# Altium schematic sheet config-bank0.SchDoc: Config FPGA - Bank 0
size Letter; CheckedBy: E. Chiu; CompanyName: Brinton Engineering, LLC; DrawnBy: J. Brinton; Engineer: J. Brinton; Address1: 3479 Edison Way; Address2: Menlo Park CA 94025; Address3: +1 (877) 778-8435; Address4: brintonengineering.com; Revision: 1; SheetNumber: 18; SheetTotal: 71
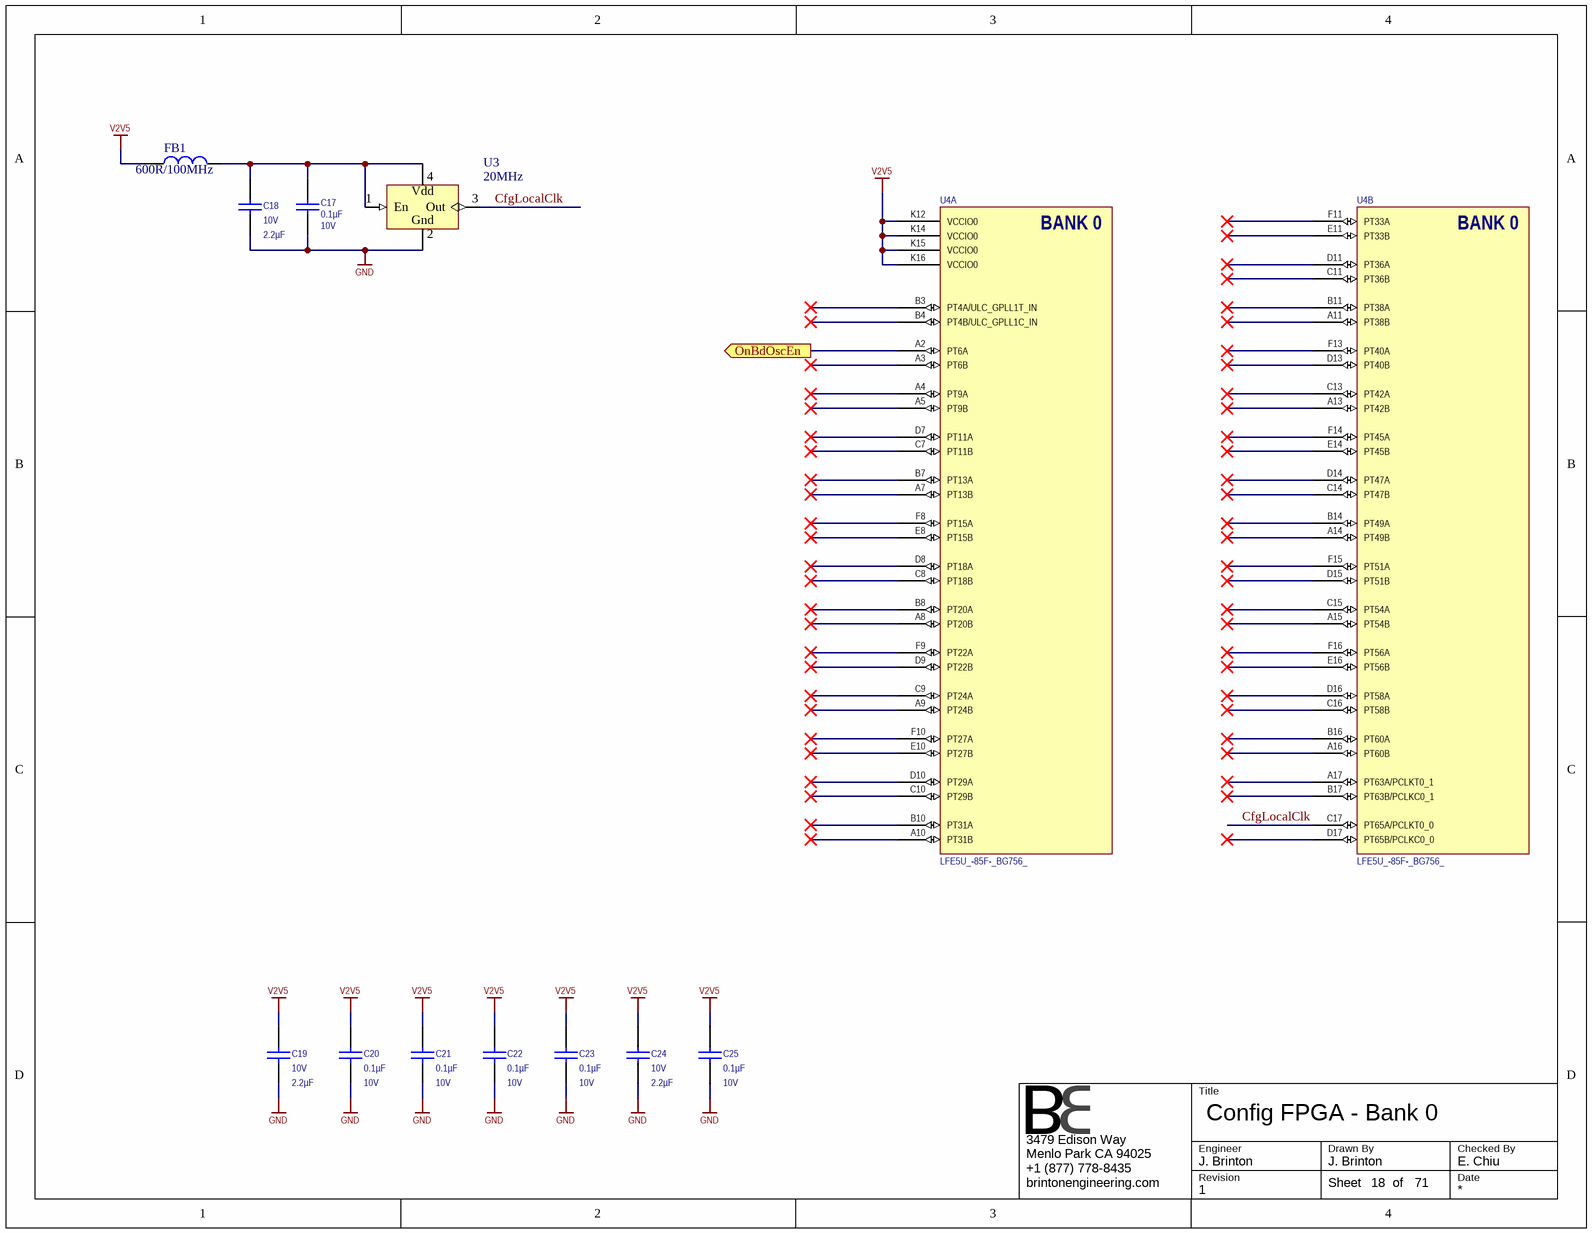
[diagram p0: config-bank0.SchDoc]

## Parts
C17  Capacitance: 0.1µF  Voltage - Rated: 10V  [CAPC1005X56N]  (hidden comment: GRM155R71A104KA01J)
C18  Voltage - Rated: 10V  Capacitance: 2.2µF  [CAPC1608X90N]  (hidden comment: GRM188R71A225KE15D)
C19  Voltage - Rated: 10V  Capacitance: 2.2µF  [CAPC1608X90N]  (hidden comment: GRM188R71A225KE15D)
C20  Capacitance: 0.1µF  Voltage - Rated: 10V  [CAPC1005X56N]  (hidden comment: GRM155R71A104KA01J)
C21  Capacitance: 0.1µF  Voltage - Rated: 10V  [CAPC1005X56N]  (hidden comment: GRM155R71A104KA01J)
C22  Capacitance: 0.1µF  Voltage - Rated: 10V  [CAPC1005X56N]  (hidden comment: GRM155R71A104KA01J)
C23  Capacitance: 0.1µF  Voltage - Rated: 10V  [CAPC1005X56N]  (hidden comment: GRM155R71A104KA01J)
C24  Voltage - Rated: 10V  Capacitance: 2.2µF  [CAPC1608X90N]  (hidden comment: GRM188R71A225KE15D)
C25  Capacitance: 0.1µF  Voltage - Rated: 10V  [CAPC1005X56N]  (hidden comment: GRM155R71A104KA01J)
FB1  600R/100MHz  [0805]
U3  value 20MHz  [OSC2.5X2P]  (hidden comment: IC Oscillator 20MHz 1.8-3.3V 50ppm 2.5x2mm)
U4  LFE5U_-85F-_BG756_  [caBGA756]  (parts A,B of 19)

## Ports
OnBdOscEn (out)

## Nets
GND: C17.1 C18.1 C19.1 C20.1 C21.1 C22.1 C23.1 C24.1 C25.1 U3.2(GND)
V2V5: C19.2 C20.2 C21.2 C22.2 C23.2 C24.2 C25.2 FB1.2 U4.K12(VCCIO0) U4.K14(VCCIO0) U4.K15(VCCIO0) U4.K16(VCCIO0)
CfgLocalClk: U3.3(Out) U4.C17(PT65A/PCLKT0_0)
OnBdOscEn: U4.A2(PT6A) ; port OnBdOscEn
NetC17_2: C17.2 C18.2 FB1.1 U3.1(En) U3.4(Vdd)

Not connected (* = marked no-connect by the designer): U4 A3(PT6B)* A4(PT9A)* A5(PT9B)* A7(PT13B)* A8(PT20B)* A9(PT24B)* A10(PT31B)* A11(PT38B)* A13(PT42B)* A14(PT49B)* A15(PT54B)* A16(PT60B)* A17(PT63A/PCLKT0_1)* B3(PT4A/ULC_GPLL1T_IN)* B4(PT4B/ULC_GPLL1C_IN)* B7(PT13A)* B8(PT20A)* B10(PT31A)* B11(PT38A)* B14(PT49A)* B16(PT60A)* B17(PT63B/PCLKC0_1)* C7(PT11B)* C8(PT18B)* C9(PT24A)* C10(PT29B)* C11(PT36B)* C13(PT42A)* C14(PT47B)* C15(PT54A)* C16(PT58B)* D7(PT11A)* D8(PT18A)* D9(PT22B)* D10(PT29A)* D11(PT36A)* D13(PT40B)* D14(PT47A)* D15(PT51B)* D16(PT58A)* D17(PT65B/PCLKC0_0)* E8(PT15B)* E10(PT27B)* E11(PT33B)* E14(PT45B)* E16(PT56B)* F8(PT15A)* F9(PT22A)* F10(PT27A)* F11(PT33A)* F13(PT40A)* F14(PT45A)* F15(PT51A)* F16(PT56A)*

## Notes on the sheet
- Title
- Engineer
- Revision
- Drawn By
- Checked By
- Date
- Sheet
- of
- (in symbol KC2520B20.0000C1GE00) Gnd
- (in symbol LFE5U_-85F-_BG756_, part A) BANK 0
- (in symbol LFE5U_-85F-_BG756_, part B) BANK 0

## Library data of the parts
C17 C20-C23 C25 = GRM155R71A104KA01J: CAP CER 0.1UF 10V 10% X7R 0402; Manufacturer: Murata Electronics North America; Manufacturer P/N: GRM155R71A104KA01J; Operating Temperature: -55°C ~ 125°C; Thickness (Max): 0.022" (0.55mm); Size / Dimension: 0.039" L x 0.020" W (1.00mm x 0.50mm); RoHS: RoHS Compliant; Mounting Type: Surface Mount, MLCC; Supplier 1: Digi-Key; ComponentLink1URL: http://www.murata.com/~/media/webrenewal/support/library/catalog/products/capacitor/mlcc/c02e.ashx; ComponentLink1Description: http://www.murata.com/~/media/webrenewal/support/library/catalog/products/capacitor/mlcc/c02e.ashx; Supplier Part Number 1: 490-6322-1-ND; Temperature Coefficient: X7R; Package / Case: 0402 (1005 Metric); Tolerance: ±10%
C18 C19 C24 = GRM188R71A225KE15D: CAP CER 2.2UF 10V 10% X7R 0603; Manufacturer: Murata Electronics North America; Manufacturer P/N: GRM188R71A225KE15D; Operating Temperature: -55°C ~ 125°C; Thickness (Max): 0.035" (0.90mm); Tolerance: ±10%; Package / Case: 0603 (1608 Metric); Temperature Coefficient: X7R; Supplier 1: Newark; Supplier 2: Digi-Key; RoHS: RoHS Compliant; Size / Dimension: 0.063" L x 0.031" W (1.60mm x 0.80mm); Mounting Type: Surface Mount, MLCC; ComponentLink1URL: http://www.murata.com/~/media/webrenewal/support/library/catalog/products/capacitor/mlcc/c02e.ashx; ComponentLink1Description: http://www.murata.com/~/media/webrenewal/support/library/catalog/products/capacitor/mlcc/c02e.ashx; Supplier Part Number 1: 72R4209; Supplier Part Number 2: 490-4520-1-ND
FB1 = INDUCTANCE1: inductance; MAN: FAIR-RITE; MAN PN: 2508056017Y2; ICCO PN: MV142024; DIST: Farnell; DIST PN: 1838838RL
U3 = KC2520B20.0000C1GE00: Dist: Digi-Key; Dist P/N: 1253-1243-1-ND; Mfg: SiTIME; Mfgr P/N: KC2520B20.0000C1GE00; Price: 1.42; HelpURL: http://www.kyocera-crystal.jp/eng/wp-content/uploads/2014/09/kc2520b_c1_e.pdf
U4 = LFE5U_-85F-_BG756_: ECP5 FPGA, 85k LUT, 756-caBGA; Manufacturer: Lattice Semiconductor; Manufacturer P/N: LFE5U_-85F-_BG756_